# EAGLE design untitled (EAGLE 9.6.1)
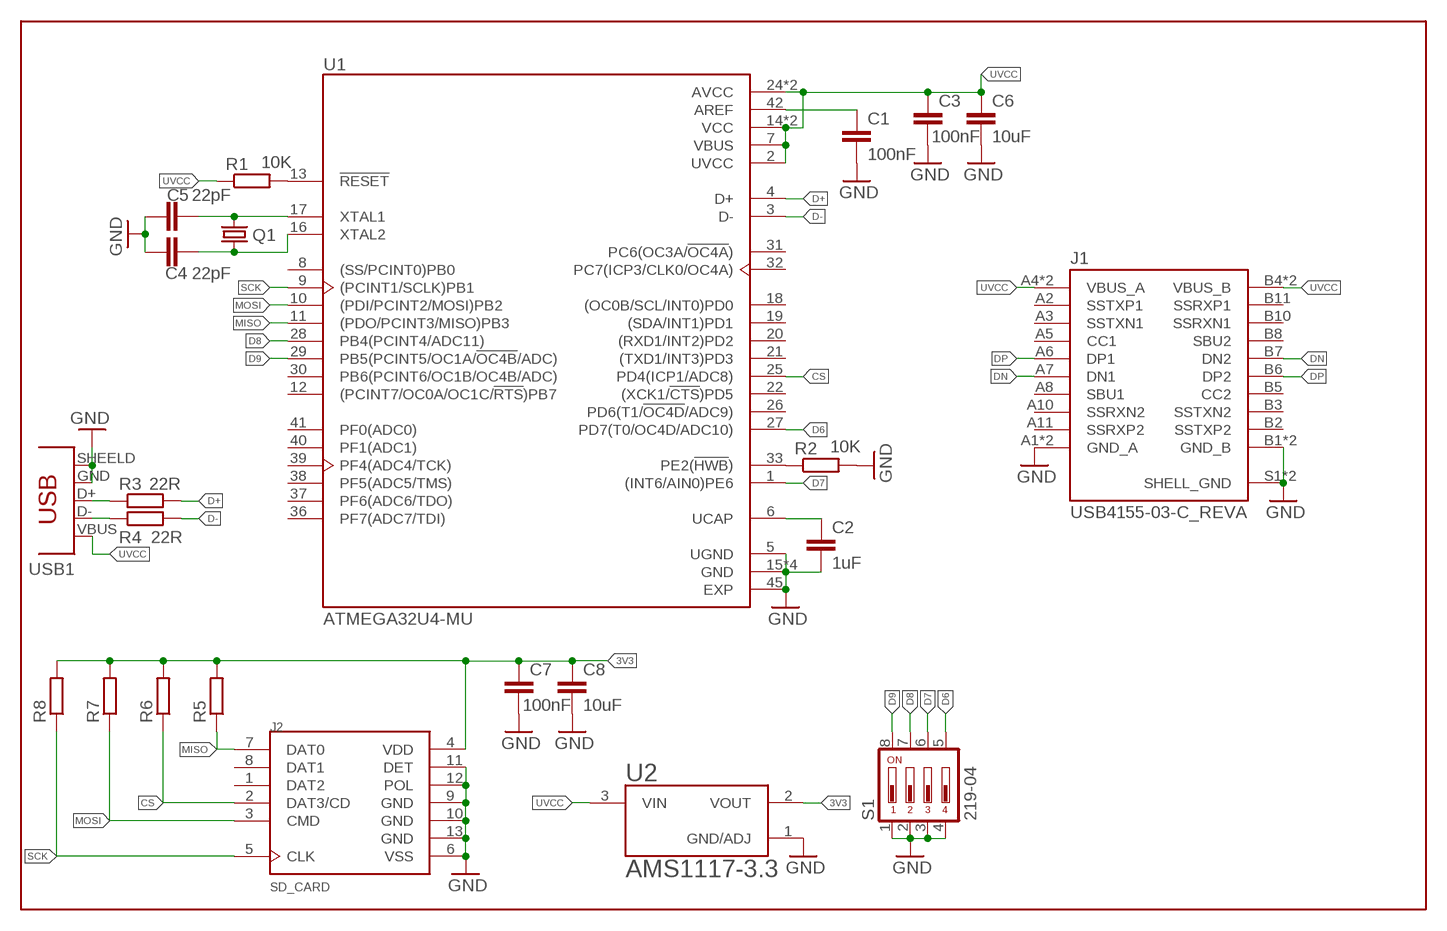
[diagram p0: schematic, sheet 1]

## Parts
C1  100nF  C-EUC0603  [C0603]
C2  1uF  C-EUC0603  [C0603]
C3  100nF  C-EUC0603  [C0603]
C4  22pF  C-EUC0603  [C0603]
C5  22pF  C-EUC0603  [C0603]
C6  10uF  C-EUC0603  [C0603]
C7  100nF  C-EUC0603  [C0603]
C8  10uF  C-EUC0603  [C0603]
J1  USB4155-03-C_REVA  [GCT_USB4155-03-C_REVA]
J2  SD_CARD  0475710001  [MOLEX_0475710001]
Q1  CRYSTALCTS406  [CTS406]
R1  10K  R-EU_R0603  [R0603]
R2  10K  R-EU_R0603  [R0603]
R3  22R  R-EU_R0603  [R0603]
R4  22R  R-EU_R0603  [R0603]
R5  R-EU_R0603  [R0603]
R6  R-EU_R0603  [R0603]
R7  R-EU_R0603  [R0603]
R8  R-EU_R0603  [R0603]
S1  219-04  [CTS-219-04]
U1  ATMEGA32U4-MU  [QFN50P700X700X100-45N]
U2  AMS1117-3.3  [SOT229P700X180-4N]
USB1  TYPE-A-MALE-SHILED  [TYPE-A-MALE]

## Nets
3V3: C7.1 C8.1 J2.4(VDD) R5.2 R6.2 R7.2 R8.2 U2.2(VOUT)
AREF: C1.1 U1.42(AREF)
CS: J2.2(DAT3/CD) R6.1 U1.25(PD4(ICP1/ADC8))
D6: S1.5 U1.27(PD7(T0/OC4D/ADC10))
D7: S1.6 U1.1((INT6/AIN0)PE6)
D8: S1.7 U1.28(PB4(PCINT4/ADC11))
D9: S1.8 U1.29(PB5(PCINT5/OC1A/!OC4B!/ADC))
D+: R3.2 U1.4(D+)
D-: R4.2 U1.3(D-)
DN: J1.A7(DN1) J1.B7(DN2) R4.1 USB1.D-
DP: J1.A6(DP1) J1.B6(DP2) R3.1 USB1.D+
GND: C1.2 C2.2 C3.2 C4.1 C5.1 C6.2 C7.2 C8.2 J1.A1(GND_A) J1.A12(GND_A) J1.B1(GND_B) J1.B12(GND_B) J1.S1(SHELL_GND) J1.S2(SHELL_GND) J2.6(VSS) J2.9(GND) J2.10(GND) J2.11(DET) J2.12(POL) J2.13(GND) R2.2 S1.1 S1.2 S1.3 S1.4 U1.5(UGND) U1.15(GND) U1.23(GND) U1.35(GND) U1.43(GND) U1.45(EXP) U2.1(GND/ADJ) USB1.GND USB1.SHEELD
MISO: J2.7(DAT0) R5.1 U1.11((PDO/PCINT3/MISO)PB3)
MOSI: J2.3(CMD) R7.1 U1.10((PDI/PCINT2/MOSI)PB2)
N$2: R1.2 U1.13(!RESET!)
N$3: C2.1 U1.6(UCAP)
N$12: R2.1 U1.33(PE2(!HWB!))
SCK: J2.5(CLK) R8.1 U1.9((PCINT1/SCLK)PB1)
UVCC: C3.1 C6.1 J1.A4(VBUS_A) J1.A9(VBUS_A) J1.B4(VBUS_B) J1.B9(VBUS_B) R1.1 U1.2(UVCC) U1.7(VBUS) U1.14(VCC) U1.24(AVCC) U1.34(VCC) U1.44(AVCC) U2.3(VIN) USB1.VBUS
XTAL1: C5.2 Q1.3 U1.17(XTAL1)
XTAL2: C4.2 Q1.1 U1.16(XTAL2)
Unconnected: J1.A2(SSTXP1) J1.A3(SSTXN1) J1.A5(CC1) J1.A8(SBU1) J1.A10(SSRXN2) J1.A11(SSRXP2) J1.B2(SSTXP2) J1.B3(SSTXN2) J1.B5(CC2) J1.B8(SBU2) J1.B10(SSRXN1) J1.B11(SSRXP1) J2.1(DAT2) J2.8(DAT1) U1.8((SS/PCINT0)PB0) U1.12((PCINT7/OC0A/OC1C/!RTS!)PB7) U1.18((OC0B/SCL/INT0)PD0) U1.19((SDA/INT1)PD1) U1.20((RXD1/INT2)PD2) U1.21((TXD1/INT3)PD3) U1.22((XCK1/!CTS!)PD5) U1.26(PD6(T1/!OC4D!/ADC9)) U1.30(PB6(PCINT6/OC1B/OC4B/ADC)) U1.31(PC6(OC3A/!OC4A!)) U1.32(PC7(ICP3/CLK0/OC4A)) U1.36(PF7(ADC7/TDI)) U1.37(PF6(ADC6/TDO)) U1.38(PF5(ADC5/TMS)) U1.39(PF4(ADC4/TCK)) U1.40(PF1(ADC1)) U1.41(PF0(ADC0))

## Library data of the parts
C1-C8 = rcl:C-EU: CAPACITOR, European symbol; SPICEPREFIX: C
J1 = USB4155-03-C_REVA:USB4155-03-C_REVA: Check availability <https://pricing.snapeda.com/parts/USB4155-03-C/Global%20Connector%20Technology/view-part?ref=eda>; AVAILABILITY: In Stock; CHECK_PRICES: https://www.snapeda.com/parts/USB4155-03-C/Global+Connector+Technology/view-part/?ref=eda; DESCRIPTION: USB-C (USB TYPE-C) USB 3.2 Gen 2 (USB 3.1 Gen 2, Superspeed + (USB 3.1)) Plug Connector 24 Position Board Edge, Cutout; Surface Mount; Through Hole, Right Angle; MF: Global Connector Technology; MP: USB4155-03-C; PACKAGE: None; PRICE: None; SNAPEDA_LINK: https://www.snapeda.com/parts/USB4155-03-C/Global+Connector+Technology/view-part/?ref=snap
J2 = MicroSD_Tiny:0475710001: Check availability <https://pricing.snapeda.com/parts/47571-0001/Molex/view-part?ref=eda>; AVAILABILITY: In Stock; CHECK_PRICES: https://www.snapeda.com/parts/47571-0001/Molex/view-part/?ref=eda; DESCRIPTION: 1.1mm Pitch microSD Card HeaderDetect Switch, Height 2.3mm | Molex Incorporated 47571-0001; MF: Molex; MP: 47571-0001; PACKAGE: None; PRICE: None; SNAPEDA_LINK: https://www.snapeda.com/parts/47571-0001/Molex/view-part/?ref=snap
Q1 = crystal:CRYSTAL: CRYSTAL; OC_FARNELL: unknown; OC_NEWARK: unknown
R1-R8 = rcl:R-EU_: RESISTOR, European symbol; SPICEPREFIX: R
S1 = switch-dil:219-04*: Surface Mount DIP Switch Series 219 SMT CTS Electronic Components Sourc: www.ctscorp.com; OC_FARNELL: unknown; OC_NEWARK: unknown
U1 = ATMEGA32U4-MU:ATMEGA32U4-MU: 8-bit Microcontrollers - MCU AVR USB 32K FLASH INDUSTRIA Check availability <https://pricing.snapeda.com/parts/ATMEGA32U4-MU/Microchip/view-part?ref=eda>; AVAILABILITY: In Stock; CHECK_PRICES: https://www.snapeda.com/parts/ATMEGA32U4-MU/Microchip/view-part/?ref=eda; DESCRIPTION: IC, 8-BIT MCU, ASSP AVR, 16MHZ, 44-VQFN; Controller Family/Series:AVR MEGA; Core Size:8bit; No. of I/O's:26; Supply Voltage Range:2.7V to 5.5V; Digital IC Case Style:VQFN; No. of Pins:44; Program Memory Size:32 KB ;RoHS Compliant: Yes; MF: Microchip; MP: ATMEGA32U4-MU; PACKAGE: VQFN-44 Atmel; PRICE: None; SNAPEDA_LINK: https://www.snapeda.com/parts/ATMEGA32U4-MU/Microchip/view-part/?ref=snap
U2 = AMS1117-3.3:AMS1117-3.3: Check availability <https://pricing.snapeda.com/parts/AMS1117-3.3/Advanced%20Monolithic%20Systems/view-part?ref=eda>; AVAILABILITY: Not in stock; CHECK_PRICES: https://www.snapeda.com/parts/AMS1117-3.3/Advanced+Monolithic+Systems/view-part/?ref=eda; DESCRIPTION: Sot223/Pkg 1-Amp 3.3-Volt Low Drop Out Voltage Regulatator; MF: Advanced Monolithic Systems; MP: AMS1117-3.3; PACKAGE: SOT-223 Seeed Technology; PRICE: None; SNAPEDA_LINK: https://www.snapeda.com/parts/AMS1117-3.3/Advanced+Monolithic+Systems/view-part/?ref=snap
USB1 = usb-connector:TYPE-A-MALE-SHILED

## Board
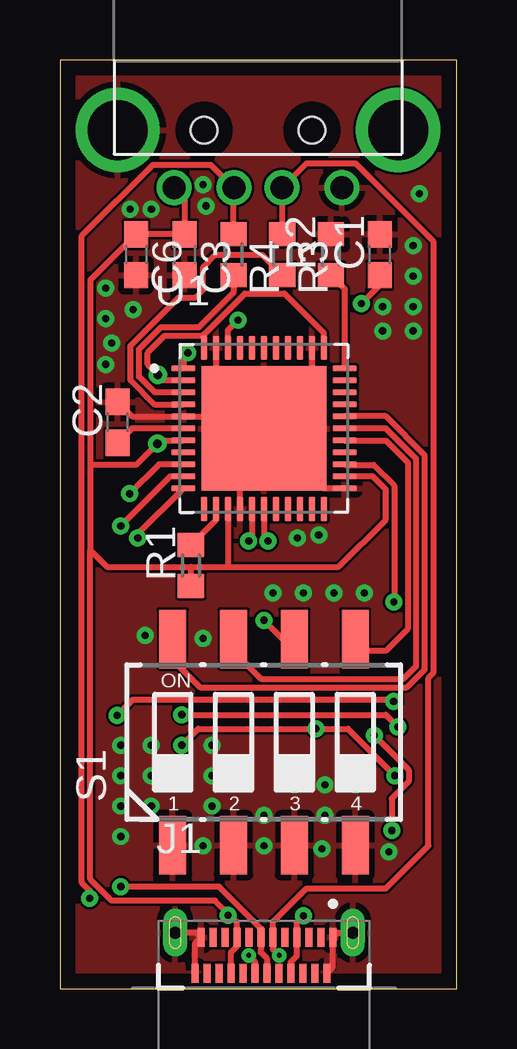
[diagram p1: board, top side]
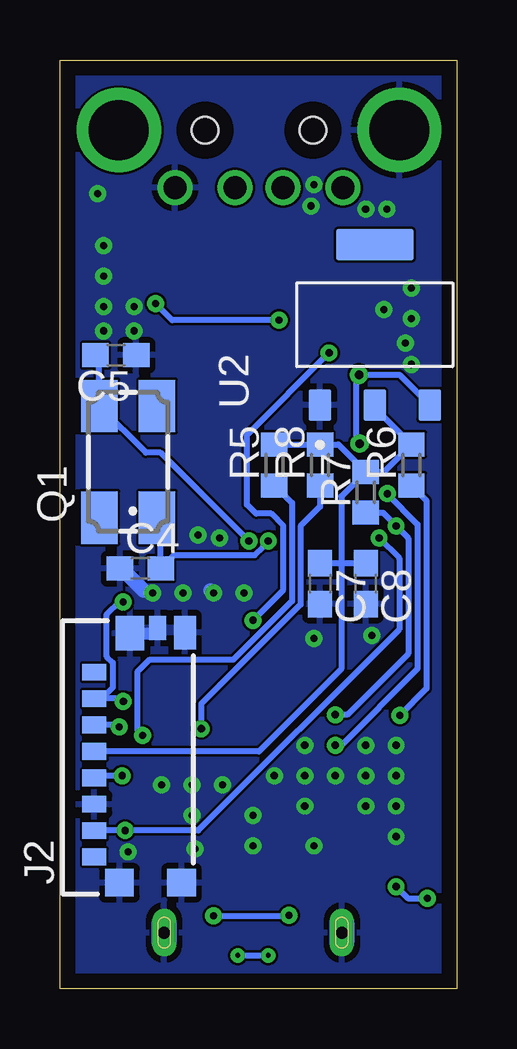
[diagram p2: board, bottom side, seen from below]

Size 16.56 x 38.73 mm. Coordinates in mm from the lower left corner, seen from the top.
Outline: 0,0 16.56,0 16.56,38.73 0,38.73 0,0
Copper layers (1*16): Top 0.035mm / dielectric 1.5mm / Bottom 0.035mm
Design rules "default *": minimum track width 6mil, minimum drill 0.3mm, track to track 4mil, track to pad 4mil, pad to pad 4mil, via to via 4mil, smd to smd 4mil, copper to edge 25mil, drill to drill 4mil, minimum pad ring 10mil, minimum via ring 8mil, stop-mask expansion 4mil, vias tented up to drill 0mil, thermal gap 10mil

### Footprints (pad centres in the part's own frame; a part is rotated, then mirrored left to right if it is on the bottom)
C0603 = smd 1.1 x 1: 1 -0.85,0; 2 0.85,0
GCT_USB4155-03-C_REVA = smd 0.3 x 0.8: A1 2.875,0.75; A2 2.375,0.75; A3 1.875,0.75; A4 1.375,0.75; A5 0.875,0.75; A6 0.375,0.75; A7 -0.125,0.75; A8 -0.625,0.75; A9 -1.125,0.75; A10 -1.625,0.75; A11 -2.125,0.75; A12 -2.625,0.75; B1 -2.875,-0.75; B2 -2.375,-0.75; B3 -1.875,-0.75; B4 -1.375,-0.75; B5 -0.875,-0.75; B6 -0.375,-0.75; B7 0.125,-0.75; B8 0.625,-0.75; B9 1.125,-0.75; B10 1.625,-0.75; B11 2.125,-0.75; B12 2.625,-0.75 | drill 0.5 pad 0.8 long: S1 -3.7,0.95; S2 3.7,0.95
MOLEX_0475710001 = smd 0.7 x 1: 1 3.55,1.415; 2 2.45,1.415; 3 1.35,1.415; 4 0.25,1.415; 5 -0.85,1.415; 6 -1.95,1.415; 7 -3.05,1.415; 8 -4.15,1.415 | smd 1.15 x 1.2: 9 -5.225,0.365; 10 -5.225,-2.225 | smd 1.4 x 0.9: 11 5.2,-2.375 | smd 1 x 0.7: 12 5.4,-1.225 | smd 1.45 x 1.2: 13 5.175,-0.075
CTS406 = smd 2.184 x 1.524: 1 -2.327,-1.2; 2 2.327,-1.2; 3 2.327,1.2; 4 -2.327,1.2
R0603 = smd 1 x 1.1: 1 -0.85,0; 2 0.85,0
CTS-219-04 = smd 1.13 x 2.44: 1 -3.81,-4.3; 2 -1.27,-4.3; 3 1.27,-4.3; 4 3.81,-4.3; 5 3.81,4.3; 6 1.27,4.3; 7 -1.27,4.3; 8 -3.81,4.3
QFN50P700X700X100-45N = smd 1.01 x 0.26: 1 -3.36,2.5; 2 -3.36,2; 3 -3.36,1.5; 4 -3.36,1; 5 -3.36,0.5; 6 -3.36,0; 7 -3.36,-0.5; 8 -3.36,-1; 9 -3.36,-1.5; 10 -3.36,-2; 11 -3.36,-2.5; 23 3.36,-2.5; 24 3.36,-2; 25 3.36,-1.5; 26 3.36,-1; 27 3.36,-0.5; 28 3.36,0; 29 3.36,0.5; 30 3.36,1; 31 3.36,1.5; 32 3.36,2; 33 3.36,2.5 | smd 0.26 x 1.01: 12 -2.5,-3.36; 13 -2,-3.36; 14 -1.5,-3.36; 15 -1,-3.36; 16 -0.5,-3.36; 17 0,-3.36; 18 0.5,-3.36; 19 1,-3.36; 20 1.5,-3.36; 21 2,-3.36; 22 2.5,-3.36; 34 2.5,3.36; 35 2,3.36; 36 1.5,3.36; 37 1,3.36; 38 0.5,3.36; 39 0,3.36; 40 -0.5,3.36; 41 -1,3.36; 42 -1.5,3.36; 43 -2,3.36; 44 -2.5,3.36 | smd 5.2 x 5.2: 45 0,0
SOT229P700X180-4N = smd 1.31 x 0.93: 1 -3.345,2.29; 2 -3.345,0; 3 -3.345,-2.29 | smd 1.31 x 3.24: 4 3.345,0
TYPE-A-MALE = drill 0.95: D+ 1,0; D- -1,0; GND 3.5,0; VBUS -3.5,0 | drill 2.5: SHEELD -5.85,2.4; SHEELD2 5.85,2.4 | hole 1.1: -2.25,2.4; 2.25,2.4

### Placement (x,y rotation side)
C1  13.34,30.61 90 top
C2  2.41,23.62 90 top
C3  5.21,30.61 270 top
C4  13.21,17.53 0 bottom
C5  14.22,26.42 180 bottom
C6  3.17,30.61 270 top
C7  5.71,16.89 270 bottom
C8  3.81,16.89 270 bottom
J1  8.51,1.4 0 top
J2  13.72,9.65 90 bottom
Q1  13.72,21.97 90 bottom
R1  5.46,17.65 90 top
R2  11.3,30.61 90 top
R3  9.27,30.61 270 top
R4  7.24,30.61 270 top
R5  7.62,21.84 90 bottom
R6  1.91,21.84 90 bottom
R7  3.81,20.7 90 bottom
R8  5.71,21.84 90 bottom
S1  8.51,10.29 0 top
U1  8.51,23.37 0 top
U2  3.43,27.69 90 bottom
USB1  8.26,33.4 0 top

### Tracks (layer width: path | path; a pad name or v marks a point on that pad's centre or on a via)
3V3
  Bottom 0.254: R5.2 R8.2 4.95,22.69 R7.2 | R7.2 3.05,21.55 R6.2 3.43,24.22 U2.2 | C8.1 4.83,17.74 | 4.83,17.74 C7.1 | R7.2 4.83,20.54 4.83,17.74 | 4.83,17.74 4.83,13.34 8.26,9.9 J2.4
AREF  (via drill 0.3)
  Top 0.254: U1.42 7.01,27.46 v7.43,27.88 | v12.57,28.57 13.34,29.34 C1.1
  Bottom 0.254: v7.43,27.88 11.88,27.88 v12.57,28.57
CS  (via drill 0.3, 0.3 pad 0.35)
  Top 0.254: U1.25 11.89,21.84 13.08,21.84 13.95,20.98 13.95,16.15 v13.92,16.13 | v2.38,11.4 3.05,12.06 13.84,12.06 v13.92,11.99
  Bottom 0.254: R6.1 1.27,20.36 1.27,12.52 v2.38,11.4 | v13.92,16.13 14.1,16.13 14.61,15.62 14.61,13.85 14.35,13.6 14.35,12.57 14.82,12.1 J2.2 14.03,12.1 v13.92,11.99
D6
  Top 0.254: S1.5 12.81,14.1 13.59,14.1 14.5,15.01 14.5,21.95 13.6,22.85 11.88,22.85 U1.27
D7  (via drill 0.3)
  Top 0.254: S1.6 9.29,14.59 v8.51,15.37 | v5.33,26.52 5.15,26.33 U1.1
  Bottom 0.254: v8.51,15.37 7.24,16.64 7.24,19.3 7.75,19.81 8.38,19.81 8.76,20.19 8.76,23.09 v5.33,26.52
D8
  Top 0.254: S1.7 7.24,14.07 8.38,12.93 14.33,12.93 14.86,13.46 14.86,22.1 13.59,23.37 U1.28
D9
  Top 0.254: S1.8 4.7,13.72 5.84,12.57 14.47,12.57 15.21,13.31 15.21,22.25 13.59,23.87 13.59,23.88 U1.29
D+
  Top 0.254: R3.2 8.42,30.61 6.48,30.61 5.97,30.1 5.97,29.15 5.65,28.83 4.96,28.83 2.95,26.82 2.95,25.38 3.96,24.37 U1.4
D-
  Top 0.254: U1.3 3.96,24.87 3.3,25.53 3.3,26.67 4.21,27.58 5.8,27.58 7.24,29.02 R4.2
DN  (via drill 0.3 pad 0.35)
  Top 0.152: 8.38,1.65 8.38,1.52 8.63,1.27
  Top 0.254: R4.1 7.24,33.38 7.25,33.39 | 7.25,33.39 USB1.D- | v2.54,4.26 6.64,4.26 8.39,2.52 J1.A7 8.38,1.65 8.38,1.52 8.63,1.27 | v1.24,3.78 1.24,4.1 0.91,4.42 0.91,31.39 3.88,34.36 6.28,34.36 7.25,33.39 | 8.63,1.27 | 8.63,1.27 J1.B7
  Bottom 0.254: v2.54,4.26 2.06,3.78 v1.24,3.78
DP  (via drill 0.2 pad 0.35)
  Top 0.152: 8.13,0.76 8.13,0.71
  Top 0.254: R3.1 9.27,33.38 USB1.D+ 9.27,33.4 10.29,34.42 12.32,34.42 15.57,31.17 15.57,13.17 15.37,12.96 15.37,5.97 13.59,4.19 10.29,4.19 10.03,3.94 8.88,2.79 J1.A6 8.88,1.66 v9.14,1.4 | v7.87,1.4 8.13,1.14 8.13,0.76 J1.B6
  Bottom 0.254: v9.14,1.4 v7.87,1.4
GND  (via drill 0.3, 0.3 pad 0.35)
  Top 0.254: U1.45 8.01,23.87 U1.5 3.02,23.87 C2.2 | U1.35 10.51,25.37 U1.45 | 8.93,23.37 U1.45 | U1.15 7.51,22.37 U1.45 | U1.43 6.51,25.37 U1.45 | U1.23 11.01,20.87 U1.45 | J1.S2 11.58,2.35 J1.A1 11.38,0.9 11.25,0.76 | J1.B1 5.63,1.9 J1.A12 5.68,2.35 J1.S1 | 11.25,0.76 11.13,0.76 | J1.B12 11.25,0.76
  Bottom 0.508: J2.13 12.72,14.83 J2.12
  Bottom 0.61: C4.1 13.98,17.53 13.08,16.62 | v10.16,16.51 10.27,16.62
  other vias: 3.56,14.73 5.97,14.61 10.92,5.84 10.79,18.92 2.54,8.89 2.54,10.16 2.54,7.62 2.54,6.35 3.81,10.16 3.81,8.89 3.81,7.62 5.08,8.89 6.35,8.89 6.35,10.16 7.62,8.89 6.35,7.62 5.97,5.97 8.51,5.97 13.72,5.71 11.43,16.51 8.89,16.51 12.7,16.51 9.91,18.8 14.73,30.99 14.73,29.72 14.73,28.45 14.73,27.43 13.46,27.43 13.46,28.45 14.99,33.15 2.92,32.51 5.97,33.53 6.1,32.64 3.81,32.51 1.91,29.21 1.91,27.94 3.05,28.32 2.16,26.92 1.91,26.04 8.51,7.24 11.05,7.24 11.05,8.51 9.78,8.51 12.32,8.51
  pour Bottom: 0,0 0,38.73 16.51,38.73 16.51,0
  pour Top: 0,0 0,38.73 16.51,38.73 16.51,0
MISO  (via drill 0.3, 0.3 pad 0.35)
  Top 0.254: U1.11 3.25,18.97 v3.25,18.8 | v13.11,10.57 14.55,9.13 14.55,8.65 13.84,7.94 v13.84,6.6
  Bottom 0.254: R5.1 6.88,20.26 6.88,16.17 9.32,13.73 12.81,13.73 13.34,13.21 13.34,10.79 v13.11,10.57 | J2.7 v13.84,6.6 10.79,6.6 2.41,14.99 2.41,17.96 v3.25,18.8
MOSI  (via drill 0.3, 0.3 pad 0.35)
  Top 0.254: U1.10 4.6,21.37 v2.54,19.3 | v5.08,11.43 13.59,11.43 v14.1,10.92
  Bottom 0.254: R7.1 3.09,19.85 v2.54,19.3 2.03,18.8 2.03,13.97 4.57,11.43 v5.08,11.43 | v14.1,10.92 14.18,11 J2.3
N$2
  Top 0.254: U1.13 6.51,19.55 R1.2
N$3
  Top 0.254: C2.1 3.01,23.37 U1.6
N$12
  Top 0.254: R2.1 11.87,29.19 U1.33
SCK  (via drill 0.3, 0.3 pad 0.35)
  Top 0.254: U1.9 4.13,21.87 v2.91,20.64 | v5.08,10.16 5.77,10.85 v10.67,10.85 12.01,10.85 v13.97,8.89
  Bottom 0.254: R8.1 5.71,20.11 6.53,19.29 6.53,16.02 10.67,11.88 v10.67,10.85 | v2.91,20.64 2.91,20.62 1.65,19.36 1.65,13.34 4.83,10.16 v5.08,10.16 | v13.97,8.89 15.04,8.89 J2.5
UVCC  (via drill 0.3 pad 0.35, 0.35)
  Top 0.254: USB1.VBUS 4.79,33.4 5.21,32.98 C3.1 C6.1 1.27,29.55 1.27,21.84 | U1.2 4.32,25.37 v4.08,25.6 v4.08,25.61 3.66,26.04 3.66,26.52 4.37,27.23 5.95,27.23 6.01,27.29 | U1.7 4.2,22.87 v4.06,22.73 3.17,21.84 1.27,21.84 | U1.44 6.01,27.29 | 6.01,27.29 7.71,28.99 9.36,28.99 11.01,27.34 U1.34 | U1.24 13.05,21.37 13.59,20.83 13.59,19.56 11.62,17.59 6.99,17.59 | 5.46,17.59 6.99,17.59 | U1.14 7.01,17.61 6.99,17.59 | R1.1 5.46,17.59 | 1.27,21.84 1.27,18.29 | 1.27,18.29 1.97,17.59 5.46,17.59 | 7.09,3.07 6.48,3.68 2.16,3.68 1.27,4.57 1.27,18.29 | J1.B9 9.63,1.12 9.88,1.38 J1.A4 9.88,2.77 v10.16,3.05 | J1.B4 7.13,1.52 7.38,1.77 J1.A9 7.38,2.78 7.09,3.07 | v7.01,3.07 7.09,3.07
  Bottom 0.254: v4.06,22.73 4.21,22.88 4.21,25.48 v4.08,25.6 2.4,25.6 U2.3 | v10.16,3.05 7.03,3.05 v7.01,3.07
XTAL1  (via drill 0.3)
  Top 0.254: U1.17 8.51,18.84 v8.68,18.67
  Bottom 0.254: C5.2 14.92,26.26 Q1.3 12.97,22.35 12.37,22.35 v8.68,18.67
XTAL2  (via drill 0.3)
  Top 0.254: U1.16 8.01,18.8 v7.87,18.67
  Bottom 0.254: v7.87,18.67 8.1,18.44 8.1,18.43 8.44,18.09 11.8,18.09 C4.2 12.36,19.49 Q1.1